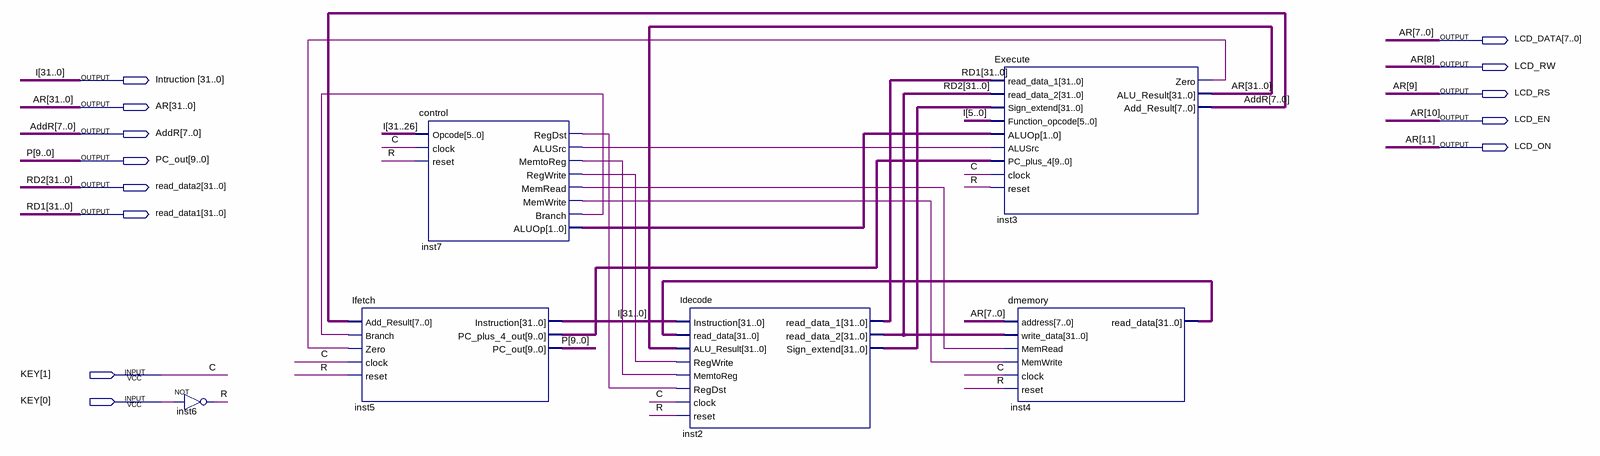
[diagram p0: schematic sheet]
// Quartus schematic MIPS_2.bdf as structural Verilog: 6 symbols, 13 pins
module MIPS_2 (
  input  [1:0] KEY,
  output [7:0] LCD_DATA,
  output LCD_RW,
  output [31:0] Intruction,
  output LCD_RS,
  output [31:0] AR,
  output LCD_EN,
  output [7:0] AddR,
  output LCD_ON,
  output [9:0] PC_out,
  output [31:0] read_data2,
  output [31:0] read_data1
);

  wire inst3_zero, inst7_alusrc, inst7_branch, inst7_memread, inst7_memtoreg, inst7_memwrite, inst7_regdst,
       inst7_regwrite, R;
  wire [1:0] inst7_aluop;
  wire [9:0] inst5_pc_plus_4_out;
  wire [31:0] inst2_sign_extend, inst4_read_data;

  not inst6 (R, KEY[0]);
  Ifetch inst5 (
    .Add_Result(AddR), .Branch(inst7_branch), .Zero(inst3_zero), .clock(KEY[1]), .reset(R),
    .Instruction(Intruction), .PC_plus_4_out(inst5_pc_plus_4_out), .PC_out(PC_out));
  control inst7 (
    .Opcode(Intruction[31:26]), .clock(KEY[1]), .reset(R), .RegDst(inst7_regdst), .ALUSrc(inst7_alusrc),
    .MemtoReg(inst7_memtoreg), .RegWrite(inst7_regwrite), .MemRead(inst7_memread), .MemWrite(inst7_memwrite),
    .Branch(inst7_branch), .ALUOp(inst7_aluop));
  Idecode inst2 (
    .Instruction(Intruction), .read_data(inst4_read_data), .RegWrite(inst7_regwrite),
    .MemtoReg(inst7_memtoreg), .RegDst(inst7_regdst), .clock(KEY[1]), .reset(R), .ALU_Result(AR),
    .read_data_1(read_data1), .read_data_2(read_data2), .Sign_extend(inst2_sign_extend));
  Execute inst3 (
    .read_data_1(read_data1), .read_data_2(read_data2), .Sign_extend(inst2_sign_extend),
    .Function_opcode(Intruction[5:0]), .ALUOp(inst7_aluop), .ALUSrc(inst7_alusrc),
    .PC_plus_4(inst5_pc_plus_4_out), .clock(KEY[1]), .reset(R), .Zero(inst3_zero), .ALU_Result(AR),
    .Add_Result(AddR));
  dmemory inst4 (
    .address(AR[7:0]), .write_data(read_data2), .MemRead(inst7_memread), .clock(KEY[1]), .reset(R),
    .MemWrite(inst7_memwrite), .read_data(inst4_read_data));

  assign LCD_DATA = AR[7:0];
  assign LCD_EN = AR[10];
  assign LCD_ON = AR[11];
  assign LCD_RS = AR[9];
  assign LCD_RW = AR[8];

  // Other names for the same wires on the sheet: C = KEY[1]; I[31:0] = Intruction; P[9:0] = PC_out;
  //   RD1[31:0] = read_data1; RD2[31:0] = read_data2
endmodule
